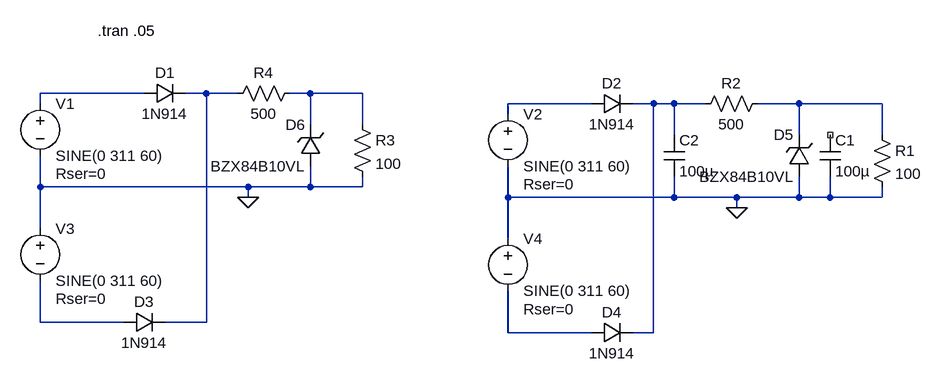
[diagram p0: schematic Diodo - RetificadorOndaCompleta_MeiaPonte_RegulacaoZener.asc]
Diodo - RetificadorOndaCompleta_MeiaPonte_RegulacaoZener.asc, the LTspice schematic file:
Version 4
SHEET 1 980 680
WIRE -224 -48 -384 -48
WIRE -128 -48 -160 -48
WIRE -80 -48 -128 -48
WIRE 32 -48 0 -48
WIRE 112 -48 32 -48
WIRE -384 -32 -384 -48
WIRE 464 -32 336 -32
WIRE 560 -32 528 -32
WIRE 592 -32 560 -32
WIRE 640 -32 592 -32
WIRE 784 -32 720 -32
WIRE 912 -32 784 -32
WIRE 336 -16 336 -32
WIRE 32 0 32 -48
WIRE 112 0 112 -48
WIRE 592 16 592 -32
WIRE 784 16 784 -32
WIRE 912 16 912 -32
WIRE -384 96 -384 48
WIRE -64 96 -384 96
WIRE 32 96 32 64
WIRE 32 96 -64 96
WIRE 112 96 112 80
WIRE 112 96 32 96
WIRE -64 112 -64 96
WIRE 336 112 336 64
WIRE 592 112 592 80
WIRE 592 112 336 112
WIRE 688 112 592 112
WIRE 784 112 784 80
WIRE 784 112 688 112
WIRE 832 112 832 80
WIRE 832 112 784 112
WIRE 912 112 912 96
WIRE 912 112 832 112
WIRE 688 128 688 112
WIRE -384 160 -384 96
WIRE 336 176 336 112
WIRE -384 304 -384 240
WIRE -256 304 -384 304
WIRE -128 304 -128 -48
WIRE -128 304 -192 304
WIRE 336 320 336 256
WIRE 464 320 336 320
WIRE 560 320 560 -32
WIRE 560 320 528 320
FLAG -64 112 0
FLAG 688 128 0
SYMBOL diode -224 -32 R270
WINDOW 0 32 32 VTop 2
WINDOW 3 0 32 VBottom 2
SYMATTR InstName D1
SYMATTR Value 1N914
SYMBOL voltage -384 -48 R0
WINDOW 123 0 0 Left 2
WINDOW 39 24 124 Left 2
SYMATTR SpiceLine Rser=0
SYMATTR InstName V1
SYMATTR Value SINE(0 311 60)
SYMBOL diode 464 -16 R270
WINDOW 0 32 32 VTop 2
WINDOW 3 0 32 VBottom 2
SYMATTR InstName D2
SYMATTR Value 1N914
SYMBOL voltage 336 -32 R0
WINDOW 123 0 0 Left 2
WINDOW 39 24 124 Left 2
SYMATTR SpiceLine Rser=0
SYMATTR InstName V2
SYMATTR Value SINE(0 311 60)
SYMBOL cap 816 16 R0
SYMATTR InstName C1
SYMATTR Value 100µ
SYMBOL voltage -384 144 R0
WINDOW 123 0 0 Left 2
WINDOW 39 24 124 Left 2
SYMATTR SpiceLine Rser=0
SYMATTR InstName V3
SYMATTR Value SINE(0 311 60)
SYMBOL diode -256 320 R270
WINDOW 0 32 32 VTop 2
WINDOW 3 0 32 VBottom 2
SYMATTR InstName D3
SYMATTR Value 1N914
SYMBOL voltage 336 160 R0
WINDOW 123 0 0 Left 2
WINDOW 39 24 124 Left 2
SYMATTR SpiceLine Rser=0
SYMATTR InstName V4
SYMATTR Value SINE(0 311 60)
SYMBOL diode 464 336 R270
WINDOW 0 32 32 VTop 2
WINDOW 3 0 32 VBottom 2
SYMATTR InstName D4
SYMATTR Value 1N914
SYMBOL res 896 0 R0
SYMATTR InstName R1
SYMATTR Value 100
SYMBOL res 736 -48 R90
WINDOW 0 0 56 VBottom 2
WINDOW 3 32 56 VTop 2
SYMATTR InstName R2
SYMATTR Value 500
SYMBOL zener 800 80 R180
WINDOW 0 24 64 Left 2
WINDOW 3 24 0 Left 2
SYMATTR InstName D5
SYMATTR Value BZX84B10VL
SYMATTR Description Diode
SYMATTR Type diode
SYMBOL res 96 -16 R0
SYMATTR InstName R3
SYMATTR Value 100
SYMBOL zener 48 64 R180
WINDOW 0 24 64 Left 2
WINDOW 3 24 0 Left 2
SYMATTR InstName D6
SYMATTR Value BZX84B10VL
SYMATTR Description Diode
SYMATTR Type diode
SYMBOL res 16 -64 R90
WINDOW 0 0 56 VBottom 2
WINDOW 3 32 56 VTop 2
SYMATTR InstName R4
SYMATTR Value 500
SYMBOL cap 576 16 R0
SYMATTR InstName C2
SYMATTR Value 100µ
TEXT -296 -144 Left 2 !.tran .05

The netlist it stands for:
* Diodo - RetificadorOndaCompleta_MeiaPonte_RegulacaoZener.asc
D1 N001 N002 1N914
V1 N001 0 SINE(0 311 60) Rser=0
D2 N004 N005 1N914
V2 N004 0 SINE(0 311 60) Rser=0
C1 NC_01 0 100µ
V3 0 N007 SINE(0 311 60) Rser=0
D3 N007 N002 1N914
V4 0 N008 SINE(0 311 60) Rser=0
D4 N008 N005 1N914
R1 N006 0 100
R2 N006 N005 500
D5 0 N006 BZX84B10VL
R3 N003 0 100
D6 0 N003 BZX84B10VL
R4 N003 N002 500
C2 N005 0 100µ
.model D D
.lib standard.dio
.tran .05
.backanno
.end